# EAGLE board ledCubeV2.0 (EAGLE 9.6.2)
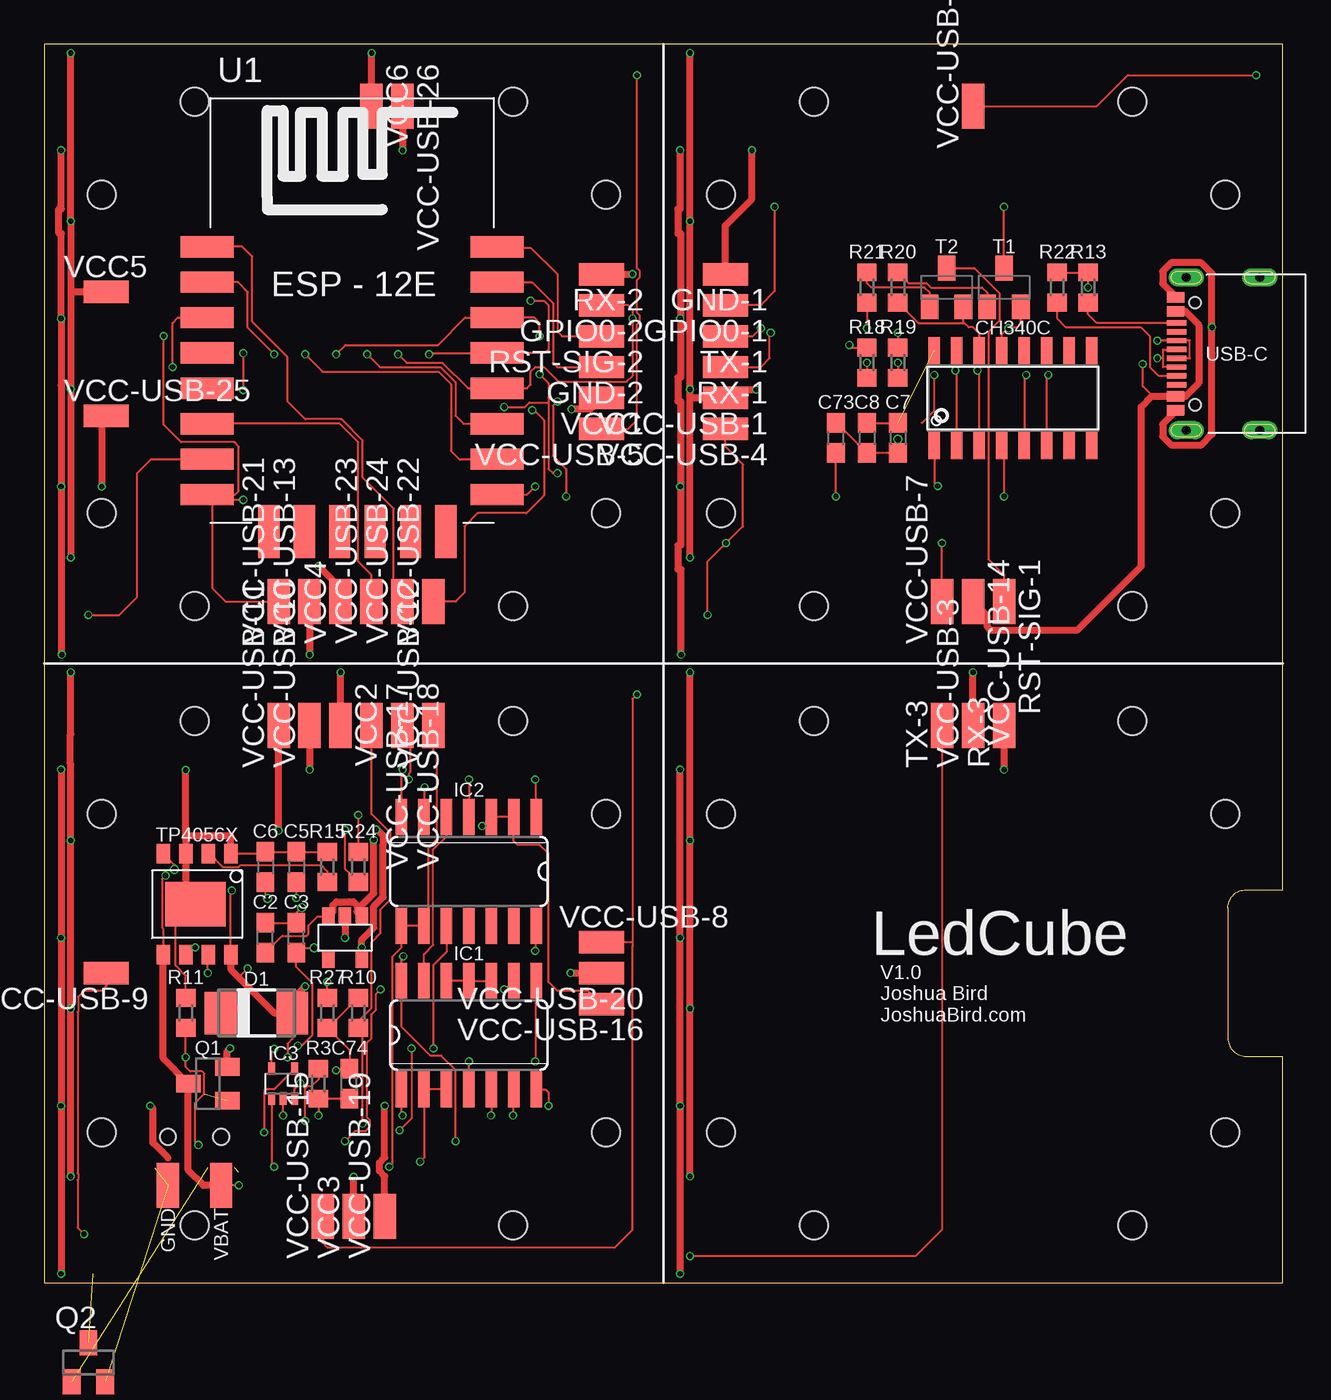
[diagram p2: board, top side]
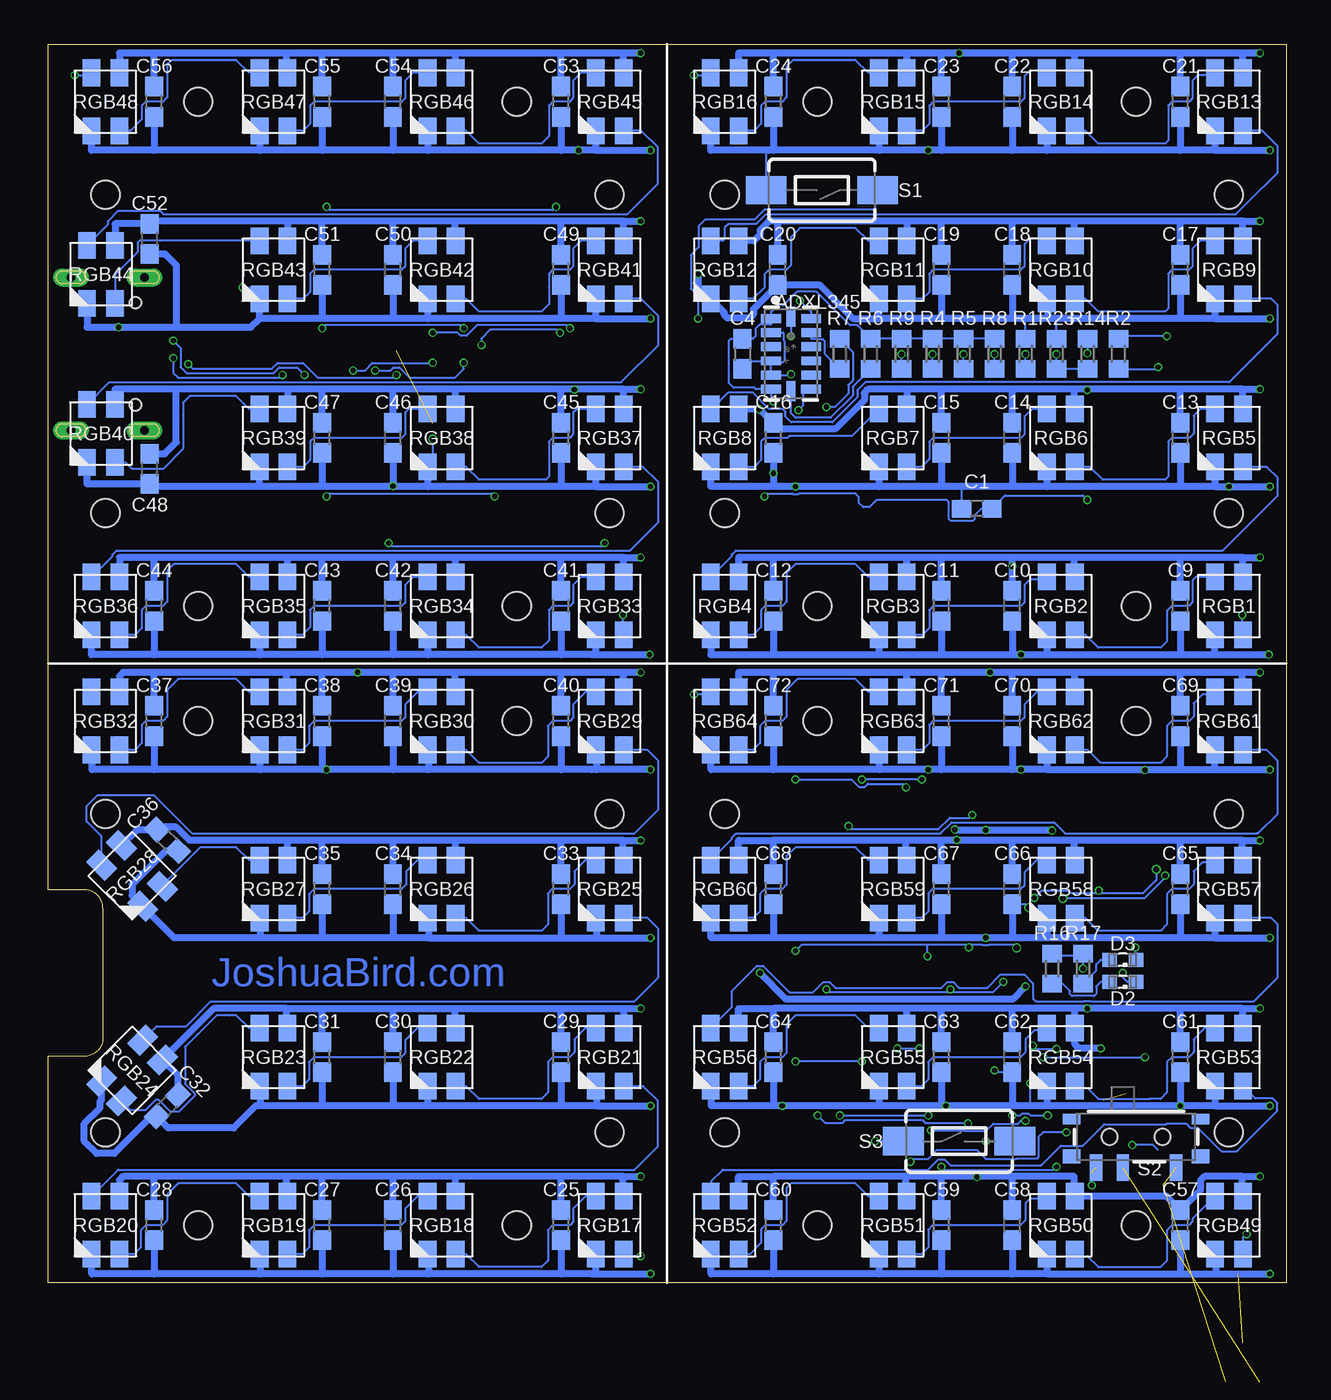
[diagram p3: board, bottom side, seen from below]

Size 70 x 70 mm. Coordinates in mm from the lower left corner, seen from the top.
Outline: 0,0 70,0 70,12.8 67.92,12.8 arc-90 66.9,13.82 66.9,21.18 arc-90 67.92,22.2 70,22.2 70,70 0,70 0,0
Copper layers (1*16): Top 0.035mm / dielectric 1.6mm / Bottom 0.035mm
Design rules "jlcpcb-2layers *": minimum track width 5mil, minimum drill 0.2mm, track to track 5mil, track to pad 5mil, pad to pad 5mil, via to via 5mil, smd to smd 5mil, copper to edge 0.2mm, drill to drill 6mil, minimum pad ring 10mil, minimum via ring 3mil, stop-mask expansion 4mil, vias tented up to drill 0.35mm, thermal gap 10mil
Net classes: 0 default: clearance 0.127 mm
Holes 1.6 mm at 43.5,31.75 61.5,31.75 66.75,26.5 66.75,8.5 61.5,3.25 43.5,3.25 38.25,8.5 38.25,26.5 26.5,31.75 31.75,26.5 26.5,38.25 31.75,43.5 38.25,43.5 43.5,38.25 61.5,38.25 66.75,43.5 66.75,61.5 61.5,66.75 43.5,66.75 38.25,61.5 26.5,66.75 31.75,61.5 8.5,66.75 3.25,61.5 8.5,38.25 3.25,43.5 8.5,31.75 3.25,26.5 8.5,3.25 31.75,8.5 26.5,3.25 3.25,8.5

## Footprints (pad centres in the part's own frame; a part is rotated, then mirrored left to right if it is on the bottom)
LGA-14 = smd 0.5 x 1.124: 1 2,1.138; 2 1.2,1.138; 3 0.4,1.138; 4 -0.4,1.138; 5 -1.2,1.138; 6 -2,1.138; 8 -2,-1.13; 9 -1.2,-1.138; 10 -0.4,-1.138; 11 0.4,-1.138; 12 1.2,-1.138; 13 2,-1.138 | smd 1.124 x 0.5: 7 -2.1,0; 14 2.1,0
C0603 = smd 1.1 x 1: 1 -0.85,0; 2 0.85,0
SOIC16 = smd 0.635 x 1.524: 1 -4.445,-2.695; 2 -3.175,-2.695; 3 -1.905,-2.695; 4 -0.635,-2.695; 5 0.635,-2.695; 6 1.905,-2.695; 7 3.175,-2.695; 8 4.445,-2.695; 9 4.445,2.695; 10 3.175,2.695; 11 1.905,2.695; 12 0.635,2.695; 13 -0.635,2.695; 14 -1.905,2.695; 15 -3.175,2.695; 16 -4.445,2.695
DO-214AC = smd 1.8 x 2.4: A 2.025,0; C -2.025,0
LED_SML0603 = smd 0.8 x 0.8: A 0.75,0; C -0.75,0
SMD1,27-2,54 = smd 1.27 x 2.54: 1 0,0
SO14 = smd 0.66 x 2.032: 1 -3.81,-3.073; 2 -2.54,-3.073; 3 -1.27,-3.073; 4 0,-3.073; 5 1.27,-3.073; 6 2.54,-3.073; 7 3.81,-3.073; 8 3.81,3.073; 9 2.54,3.073; 10 1.27,3.073; 11 0,3.073; 12 -1.27,3.073; 13 -2.54,3.073; 14 -3.81,3.073
SC70-5 = smd 0.4 x 0.7: 1 -0.65,-0.85; 2 0,-0.85; 3 0.65,-0.85; 4 0.65,0.85; 5 -0.65,0.85
TSOP-5 = smd 0.7 x 1: 1 0.95,0.95; 2 0,0.95; 3 -0.95,0.95; 4 -0.95,-1.45; 5 0.95,-1.45
SOT23 = smd 1 x 1.4: 1 -0.95,-1.1; 2 0.95,-1.1; 3 0,1.1
R0603 = smd 1 x 1.1: 1 -0.85,0; 2 0.85,0
WS2812B-MINI = smd 1.5 x 1: 1 -1.64,0.79; 2 -1.64,-0.79; 3 1.64,-0.79; 4 1.64,0.79
TACTILE_SWITCH_SMD_6.0X3.5MM = smd 2.3 x 1.6: 1 -3.15,0; 2 3.15,0
SWITCH_SPST_SMD_A = smd 0.7 x 1.5: 1 -2.25,-1.75; 2 -0.75,-1.75; 3 2.25,-1.75 | smd 1 x 0.6: GND1 -3.65,1; GND3 3.65,1 | smd 1 x 0.8: GND2 -3.65,-1.1; GND4 3.65,-1.1 | hole 0.9: -1.5,0; 1.5,0
SOT23-BEC = smd 1 x 1.4: B -0.95,-1.1; C 0,1.1; E 0.95,-1.1
ESPO8 = smd 1.1 x 0.76: 1 0,2.54; 2 0,1.27; 3 0,0; 4 0,-1.27; 5 5.7,-1.27; 6 5.7,0; 7 5.7,1.27; 8 5.7,2.54 | smd 2.513 x 3.402: 9 2.85,0.55
ESP12E-SMD = smd 3 x 1.2: ADC -8.3,3.8; CH_PD -8.3,1.8; GND 8.1,-8.2; GPIO0 8.1,-2.2; GPIO2 8.1,-4.2; GPIO4 8.1,-0.2; GPIO5 8.1,1.8; GPIO12 -8.3,-4.2; GPIO13 -8.3,-6.2; GPIO14 -8.3,-2.2; GPIO15 8.1,-6.2; GPIO16 -8.3,-0.2; RESET -8.3,5.8; RXD0 8.1,3.8; TXD0 8.1,5.8; VCC -8.3,-8.2 | smd 1.2 x 3: CS0 -4.8,-10.3; GPIO9 -0.8,-10.3; GPIO10 1.2,-10.3; MISO -2.8,-10.3; MOSI 3.2,-10.3; SCLK 5.2,-10.3
USB-C = smd 0.6 x 1: 1 -3.2,0.05; 2 -2.4,0.05; 11 2.4,0.05; 12 3.2,0.05 | smd 0.3 x 1.1: 3 -1.75,0; 4 -1.25,0; 5 -0.75,0; 6 -0.25,0; 7 0.25,0; 8 0.75,0; 9 1.25,0; 10 1.75,0 | drill 0.5 long: P$1 -4.32,-0.55; P$2 4.32,-0.55; P$3 4.32,-4.7; P$5 -4.32,-4.7 | hole 0.65: -2.89,-1.05; 2.89,-1.05

## Placement (x,y rotation side)
ADXL345  [LGA-14]  28,52.5 90 bottom
C1  0.1uF  [C0603]  17.5,43.75 180 bottom
C2  1uF  [C0603]  12.5,19.5 90 top
C3  1uF  [C0603]  14.25,19.5 90 top
C4  0.1uF  [C0603]  30.75,52.5 270 bottom
C5  0.1uF  [C0603]  14.25,23.5 270 top
C6  0.1uF  [C0603]  12.5,23.5 270 top
C7  10uF  [C0603]  48.25,47.75 270 top
C8  0.1uF  [C0603]  46.5,47.75 270 top
C9  0.1uF  [C0603]  6,38.25 90 bottom
C10  0.1uF  [C0603]  15.5,38.25 90 bottom
C11  0.1uF  [C0603]  19.5,38.25 90 bottom
C12  0.1uF  [C0603]  29,38.25 90 bottom
C13  0.1uF  [C0603]  6,47.75 90 bottom
C14  0.1uF  [C0603]  15.5,47.75 90 bottom
C15  0.1uF  [C0603]  19.5,47.75 90 bottom
C16  0.1uF  [C0603]  29,47.75 90 bottom
C17  0.1uF  [C0603]  6,57.25 90 bottom
C18  0.1uF  [C0603]  15.5,57.25 90 bottom
C19  0.1uF  [C0603]  19.5,57.25 90 bottom
C20  0.1uF  [C0603]  28.75,57.25 90 bottom
C21  0.1uF  [C0603]  6,66.75 90 bottom
C22  0.1uF  [C0603]  15.5,66.75 90 bottom
C23  0.1uF  [C0603]  19.5,66.75 90 bottom
C24  0.1uF  [C0603]  29,66.75 90 bottom
C25  0.1uF  [C0603]  41,3.25 90 bottom
C26  0.1uF  [C0603]  50.5,3.25 90 bottom
C27  0.1uF  [C0603]  54.5,3.25 90 bottom
C28  0.1uF  [C0603]  64,3.25 90 bottom
C29  0.1uF  [C0603]  41,12.75 90 bottom
C30  0.1uF  [C0603]  50.5,12.75 90 bottom
C31  0.1uF  [C0603]  54.5,12.75 90 bottom
C32  0.1uF  [C0603]  63.25,10 45 bottom
C33  0.1uF  [C0603]  41,22.25 90 bottom
C34  0.1uF  [C0603]  50.5,22.25 90 bottom
C35  0.1uF  [C0603]  54.5,22.25 90 bottom
C36  0.1uF  [C0603]  63.25,25 135 bottom
C37  0.1uF  [C0603]  64,31.75 90 bottom
C38  0.1uF  [C0603]  54.5,31.75 90 bottom
C39  0.1uF  [C0603]  50.5,31.75 90 bottom
C40  0.1uF  [C0603]  41,31.75 90 bottom
C41  0.1uF  [C0603]  41,38.25 90 bottom
C42  0.1uF  [C0603]  50.5,38.25 90 bottom
C43  0.1uF  [C0603]  54.5,38.25 90 bottom
C44  0.1uF  [C0603]  64,38.25 90 bottom
C45  0.1uF  [C0603]  41,47.75 90 bottom
C46  0.1uF  [C0603]  50.5,47.75 90 bottom
C47  0.1uF  [C0603]  54.5,47.75 90 bottom
C48  0.1uF  [C0603]  64.25,46 90 bottom
C49  0.1uF  [C0603]  41,57.25 90 bottom
C50  0.1uF  [C0603]  50.5,57.25 90 bottom
C51  0.1uF  [C0603]  54.5,57.25 90 bottom
C52  0.1uF  [C0603]  64.25,59 90 bottom
C53  0.1uF  [C0603]  41,66.75 90 bottom
C54  0.1uF  [C0603]  50.5,66.75 90 bottom
C55  0.1uF  [C0603]  54.5,66.75 90 bottom
C56  0.1uF  [C0603]  64,66.75 90 bottom
C57  0.1uF  [C0603]  6,3.25 90 bottom
C58  0.1uF  [C0603]  15.5,3.25 90 bottom
C59  0.1uF  [C0603]  19.5,3.25 90 bottom
C60  0.1uF  [C0603]  29,3.25 90 bottom
C61  0.1uF  [C0603]  6,12.75 90 bottom
C62  0.1uF  [C0603]  15.5,12.75 90 bottom
C63  0.1uF  [C0603]  19.5,12.75 90 bottom
C64  0.1uF  [C0603]  29,12.75 90 bottom
C65  0.1uF  [C0603]  6,22.25 90 bottom
C66  0.1uF  [C0603]  15.5,22.25 90 bottom
C67  0.1uF  [C0603]  19.5,22.25 90 bottom
C68  0.1uF  [C0603]  29,22.25 90 bottom
C69  0.1uF  [C0603]  6,31.75 90 bottom
C70  0.1uF  [C0603]  15.5,31.75 90 bottom
C71  0.1uF  [C0603]  19.5,31.75 90 bottom
C72  0.1uF  [C0603]  29,31.75 90 bottom
C73  0.1uF  [C0603]  44.75,47.75 90 top
C74  1uF  [C0603]  17.25,11.25 90 top
CH340C  CH340G  [SOIC16]  54.75,50 0 top
D1  SS14  [DO-214AC]  12,15.25 0 top
D2  RED  [LED_SML0603]  9.25,17 180 bottom
D3  GREEN  [LED_SML0603]  9.25,18.25 180 bottom
GND  [SMD1,27-2,54]  7,5.5 0 top
GND-1  GND  [SMD1,27-2,54]  38.5,57 90 top
GND-2  RX  [SMD1,27-2,54]  31.5,51.75 90 top
GPIO0-1  GPIO0  [SMD1,27-2,54]  38.5,55.25 90 top
GPIO0-2  GPIO0  [SMD1,27-2,54]  31.5,55.25 90 top
IC1  74HC02D  [SO14]  24,14 0 top
IC2  74HC02D  [SO14]  24,23.25 180 top
IC3  74AHC1G08DCK  [SC70-5]  13.5,11.25 0 top
NCP114  NCP114  [TSOP-5]  17,19.75 0 top
Q1  BSS84  [SOT23]  9.25,11.25 90 top
Q2  BSS123  [SOT23]  2.5,-4.5 0 top  (outside the outline)
R1  10k  [R0603]  14.75,52.5 270 bottom
R2  10k  [R0603]  9.5,52.5 270 bottom
R3  10k  [R0603]  15.5,11.25 270 top
R4  10k  [R0603]  20,52.5 270 bottom
R5  10k  [R0603]  18.25,52.5 270 bottom
R6  10k  [R0603]  23.5,52.5 90 bottom
R7  10k  [R0603]  25.25,52.5 90 bottom
R8  10k  [R0603]  16.5,52.5 90 bottom
R9  10k  [R0603]  21.75,52.5 90 bottom
R10  10k  [R0603]  17.75,15.25 90 top
R11  10k  [R0603]  8,15.25 270 top
R13  5.1k  [R0603]  59,56.25 270 top
R14  10k  [R0603]  11.25,52.5 90 bottom
R15  5.1k  [R0603]  16,23.5 270 top
R16  5.1k  [R0603]  13.25,17.75 90 bottom
R17  5.1k  [R0603]  11.5,17.75 90 bottom
R18  470  [R0603]  46.5,52 270 top
R19  470  [R0603]  48.25,52 270 top
R20  10k  [R0603]  48.25,56.25 270 top
R21  10k  [R0603]  46.5,56.25 270 top
R22  5.1k  [R0603]  57.25,56.25 270 top
R23  2.7k  [R0603]  13,52.5 90 bottom
R24  10k  [R0603]  17.75,23.5 90 top
R27  10k  [R0603]  16,15.25 270 top
RGB1  WS2812B  [WS2812B-MINI]  3.25,38.25 270 bottom
RGB2  WS2812B  [WS2812B-MINI]  12.75,38.25 270 bottom
RGB3  WS2812B  [WS2812B-MINI]  22.25,38.25 270 bottom
RGB4  WS2812B  [WS2812B-MINI]  31.75,38.25 270 bottom
RGB5  WS2812B  [WS2812B-MINI]  3.25,47.75 270 bottom
RGB6  WS2812B  [WS2812B-MINI]  12.75,47.75 270 bottom
RGB7  WS2812B  [WS2812B-MINI]  22.25,47.75 270 bottom
RGB8  WS2812B  [WS2812B-MINI]  31.75,47.75 270 bottom
RGB9  WS2812B  [WS2812B-MINI]  3.25,57.25 270 bottom
RGB10  WS2812B  [WS2812B-MINI]  12.75,57.25 270 bottom
RGB11  WS2812B  [WS2812B-MINI]  22.25,57.25 270 bottom
RGB12  WS2812B  [WS2812B-MINI]  31.75,57.25 270 bottom
RGB13  WS2812B  [WS2812B-MINI]  3.25,66.75 270 bottom
RGB14  WS2812B  [WS2812B-MINI]  12.75,66.75 270 bottom
RGB15  WS2812B  [WS2812B-MINI]  22.25,66.75 270 bottom
RGB16  WS2812B  [WS2812B-MINI]  31.75,66.75 270 bottom
RGB17  WS2812B  [WS2812B-MINI]  38.25,3.25 270 bottom
RGB18  WS2812B  [WS2812B-MINI]  47.75,3.25 270 bottom
RGB19  WS2812B  [WS2812B-MINI]  57.25,3.25 270 bottom
RGB20  WS2812B  [WS2812B-MINI]  66.75,3.25 270 bottom
RGB21  WS2812B  [WS2812B-MINI]  38.25,12.75 270 bottom
RGB22  WS2812B  [WS2812B-MINI]  47.75,12.75 270 bottom
RGB23  WS2812B  [WS2812B-MINI]  57.25,12.75 270 bottom
RGB24  WS2812B  [WS2812B-MINI]  65.25,12 225 bottom
RGB25  WS2812B  [WS2812B-MINI]  38.25,22.25 270 bottom
RGB26  WS2812B  [WS2812B-MINI]  47.75,22.25 270 bottom
RGB27  WS2812B  [WS2812B-MINI]  57.25,22.25 270 bottom
RGB28  WS2812B  [WS2812B-MINI]  65.25,23 315 bottom
RGB29  WS2812B  [WS2812B-MINI]  38.25,31.75 270 bottom
RGB30  WS2812B  [WS2812B-MINI]  47.75,31.75 270 bottom
RGB31  WS2812B  [WS2812B-MINI]  57.25,31.75 270 bottom
RGB32  WS2812B  [WS2812B-MINI]  66.75,31.75 270 bottom
RGB33  WS2812B  [WS2812B-MINI]  38.25,38.25 270 bottom
RGB34  WS2812B  [WS2812B-MINI]  47.75,38.25 270 bottom
RGB35  WS2812B  [WS2812B-MINI]  57.25,38.25 270 bottom
RGB36  WS2812B  [WS2812B-MINI]  66.75,38.25 270 bottom
RGB37  WS2812B  [WS2812B-MINI]  38.25,47.75 270 bottom
RGB38  WS2812B  [WS2812B-MINI]  47.75,47.75 270 bottom
RGB39  WS2812B  [WS2812B-MINI]  57.25,47.75 270 bottom
RGB40  WS2812B  [WS2812B-MINI]  67,48 270 bottom
RGB41  WS2812B  [WS2812B-MINI]  38.25,57.25 270 bottom
RGB42  WS2812B  [WS2812B-MINI]  47.75,57.25 270 bottom
RGB43  WS2812B  [WS2812B-MINI]  57.25,57.25 270 bottom
RGB44  WS2812B  [WS2812B-MINI]  67,57 270 bottom
RGB45  WS2812B  [WS2812B-MINI]  38.25,66.75 270 bottom
RGB46  WS2812B  [WS2812B-MINI]  47.75,66.75 270 bottom
RGB47  WS2812B  [WS2812B-MINI]  57.25,66.75 270 bottom
RGB48  WS2812B  [WS2812B-MINI]  66.75,66.75 270 bottom
RGB49  WS2812B  [WS2812B-MINI]  3.25,3.25 270 bottom
RGB50  WS2812B  [WS2812B-MINI]  12.75,3.25 270 bottom
RGB51  WS2812B  [WS2812B-MINI]  22.25,3.25 270 bottom
RGB52  WS2812B  [WS2812B-MINI]  31.75,3.25 270 bottom
RGB53  WS2812B  [WS2812B-MINI]  3.25,12.75 270 bottom
RGB54  WS2812B  [WS2812B-MINI]  12.75,12.75 270 bottom
RGB55  WS2812B  [WS2812B-MINI]  22.25,12.75 270 bottom
RGB56  WS2812B  [WS2812B-MINI]  31.75,12.75 270 bottom
RGB57  WS2812B  [WS2812B-MINI]  3.25,22.25 270 bottom
RGB58  WS2812B  [WS2812B-MINI]  12.75,22.25 270 bottom
RGB59  WS2812B  [WS2812B-MINI]  22.25,22.25 270 bottom
RGB60  WS2812B  [WS2812B-MINI]  31.75,22.25 270 bottom
RGB61  WS2812B  [WS2812B-MINI]  3.25,31.75 270 bottom
RGB62  WS2812B  [WS2812B-MINI]  12.75,31.75 270 bottom
RGB63  WS2812B  [WS2812B-MINI]  22.25,31.75 270 bottom
RGB64  WS2812B  [WS2812B-MINI]  31.75,31.75 270 bottom
RST-SIG-1  RST-SIG  [SMD1,27-2,54]  54.25,38.5 180 top
RST-SIG-2  TX  [SMD1,27-2,54]  31.5,53.5 90 top
RX-1  RX  [SMD1,27-2,54]  38.5,51.75 90 top
RX-2  GND  [SMD1,27-2,54]  31.5,57 90 top
RX-3  GND  [SMD1,27-2,54]  54.25,31.5 0 top
S1  prog  [TACTILE_SWITCH_SMD_6.0X3.5MM]  26.25,61.75 180 bottom
S2  ON/CHRG  [SWITCH_SPST_SMD_A]  8.5,8.25 0 bottom
S3  reset  [TACTILE_SWITCH_SMD_6.0X3.5MM]  18.5,8 0 bottom
T1  PMBT3904  [SOT23-BEC]  54.25,56.25 0 top
T2  PMBT3904  [SOT23-BEC]  51,56.25 0 top
TP4056X  [ESPO8]  8,24.25 270 top
TX-1  TX  [SMD1,27-2,54]  38.5,53.5 90 top
TX-3  DIN  [SMD1,27-2,54]  50.75,31.5 0 top
U1  ESP12-E  [ESP12E-SMD]  17.5,52.75 0 top
USB-C  USB-C  [USB-C]  64,52.5 90 top
VBAT  [SMD1,27-2,54]  10,5.5 180 top
VCC1  VBAT  [SMD1,27-2,54]  31.5,50 90 top
VCC2  VBAT  [SMD1,27-2,54]  16.75,31.5 180 top
VCC3  VBAT  [SMD1,27-2,54]  17.5,3.75 0 top
VCC4  VBAT  [SMD1,27-2,54]  16.75,38.5 0 top
VCC5  VBAT  [SMD1,27-2,54]  3.5,56 270 top
VCC6  VBAT  [SMD1,27-2,54]  18.5,66.5 180 top
VCC-USB-1  VBAT  [SMD1,27-2,54]  38.5,50 90 top
VCC-USB-3  VBAT  [SMD1,27-2,54]  52.5,31.5 0 top
VCC-USB-4  DIN  [SMD1,27-2,54]  38.5,48.25 90 top
VCC-USB-5  DOUT  [SMD1,27-2,54]  31.5,48.25 90 top
VCC-USB-6  DOUT  [SMD1,27-2,54]  52.5,66.5 0 top
VCC-USB-7  DIN  [SMD1,27-2,54]  50.75,38.5 0 top
VCC-USB-8  DOUT  [SMD1,27-2,54]  31.5,19.25 270 top
VCC-USB-9  DIN  [SMD1,27-2,54]  3.5,17.5 90 top
VCC-USB-10  GND  [SMD1,27-2,54]  15,31.5 0 top
VCC-USB-11  VCC  [SMD1,27-2,54]  13.25,31.5 0 top
VCC-USB-12  INT1  [SMD1,27-2,54]  22,31.5 0 top
VCC-USB-13  GND  [SMD1,27-2,54]  15,38.5 0 top
VCC-USB-14  VCC-USB  [SMD1,27-2,54]  52.5,38.5 180 top
VCC-USB-15  DOUT  [SMD1,27-2,54]  15.75,3.75 0 top
VCC-USB-16  RST-SIG  [SMD1,27-2,54]  31.5,15.75 90 top
VCC-USB-17  GPIO12  [SMD1,27-2,54]  18.5,31.5 180 top
VCC-USB-18  RST-PIN  [SMD1,27-2,54]  20.25,31.5 180 top
VCC-USB-19  GND  [SMD1,27-2,54]  19.25,3.75 0 top
VCC-USB-20  VCC-USB  [SMD1,27-2,54]  31.5,17.5 90 top
VCC-USB-21  VCC  [SMD1,27-2,54]  13.25,38.5 0 top
VCC-USB-22  INT1  [SMD1,27-2,54]  22,38.5 0 top
VCC-USB-23  GPIO12  [SMD1,27-2,54]  18.5,38.5 0 top
VCC-USB-24  RST-PIN  [SMD1,27-2,54]  20.25,38.5 0 top
VCC-USB-25  GND  [SMD1,27-2,54]  3.5,49 270 top
VCC-USB-26  GND  [SMD1,27-2,54]  20.25,66.5 180 top

## Tracks (layer width: path | path; a pad name or v marks a point on that pad's centre or on a via)
ADC  (via drill 0.3)
  Top 0.127: v13,52.47 11.5,53.97 11.5,56 10.95,56.55 U1.ADC
  Bottom 0.127: v13,52.47 R23.1 R14.1
D+  (via drill 0.3)
  Top 0.127: USB-C.6 64.75,52.25 64.75,53.25 USB-C.8 v62.92,53.25 | v55.5,51.31 55.38,51.19 CH340C.5
  Bottom 0.127: v62.92,53.25 62.5,52.83 62.5,51.75 62.15,51.4 57.25,51.4 56.92,51.72 55.92,51.72 v55.5,51.31
D-  (via drill 0.3)
  Top 0.127: USB-C.7 63.25,52.75 63.25,52.25 | USB-C.5 63.25,51.75 63.25,52.25 | 63.25,52.25 v62.92,52.25 | v56.75,51.31 56.66,51.21 CH340C.6
  Bottom 0.127: v62.92,52.25 62.92,51.42 62.65,51.14 56.91,51.14 v56.75,51.31
DIN-1  (via drill 0.3)
  Top 0.127: VCC-USB-7.1 v50.75,41.81 | v37.5,37.75 37.5,40.77 v38.53,41.81 39.48,42.75 39.5,42.75 39.5,46.25 38.5,47.25 VCC-USB-4.1
  Bottom 0.127: v50.75,41.81 50.59,41.64 38.7,41.64 v38.53,41.81 | RGB33.4 37.5,36.65 v37.5,37.75
DIN-2  (via drill 0.3)
  Top 0.127: VCC-USB-9.1 3.5,16.75 3.25,16.5 2.25,16.5 1.92,16.17 1.92,15.33 1.89,15.3 1.89,6.2 1.92,6.17 1.92,5.83 1.89,5.8 1.89,3.11 v2.25,2.75
  Bottom 0.127: v2.25,2.75 2.46,2.54 RGB49.4
DIN-4  (via drill 0.3)
  Top 0.127: TX-3.1 50.75,3 49.25,1.5 v36.5,1.5
  Bottom 0.127: v36.5,1.5 37.35,1.5 RGB17.4
DOUT-1  (via drill 0.3)
  Top 0.127: VCC-USB-6.1 59.5,66.5 61.25,68.25 v68.5,68.25
  Bottom 0.127: v68.5,68.25 67.68,68.25 RGB48.2
DOUT-2  (via drill 0.3)
  Top 0.127: VCC-USB-15.1 15.75,2.25 16,2 32.25,2 33.25,3 33.25,19 33.25,19.25 | v33.5,33.25 33.25,33 33.25,19.25 | VCC-USB-8.1 33.25,19.25
  Bottom 0.127: RGB64.2 32.68,33.25 v33.5,33.25
DOUT-3  (via drill 0.3)
  Top 0.127: VCC-USB-5.1 33,48.25 33.5,48.75 33.5,54.16 33.67,54.33 33.67,54.67 33.5,54.84 33.5,56.66 33.67,56.83 33.67,57.17 33.5,57.34 v33.5,68.25
  Bottom 0.127: v33.5,68.25 32.68,68.25 RGB16.2
DTR  (via drill 0.3)
  Top 0.127: CH340C.13 54.12,53.61 54.5,54 | 54.5,54 55,54 55.2,54.2 T1.E | R21.2 v46.5,53.95 | v54.5,53.95 54.5,54
  Bottom 0.127: v46.5,53.95 46.66,54.11 54.34,54.11 v54.5,53.95
EN  (via drill 0.3)
  Top 0.127: v7.25,51.75 7.25,54.25 7.55,54.55 U1.CH_PD
  Bottom 0.127: R2.2 7.35,51.65 v7.25,51.75
GND-1  (via drill 0.3, 0.35)
  Top 0.127: R22.1 R13.1 v59,56.25 | C73.2 44.8,48.6 C8.2 C7.2 v48.25,47.67 | CH340C.1 50.3,45.22 v50.5,45.03
  Top 0.4: USB-C.1 63.95,49.26 63.22,48.52 63.22,47.84 63.7,47.35 65.4,47.35 66,47.95 66,52.5 v66,54 66,57.05 65.4,57.65 63.7,57.65 63.22,57.16 63.22,56.48 63.95,55.74 USB-C.12 | v36,35.5 36,40.32 | 36,40.32 35.82,40.32 | v35.95,64 35.95,60.68 35.82,60.68 35.82,59.32 35.97,59.32 35.97,54.5 | 35.97,54.5 35.97,51.18 35.82,51.18 35.82,49.82 35.97,49.82 35.97,45 | 35.82,40.32 35.82,41.68 35.97,41.68 35.97,45 | 35.82,40.32 36,40.32 | v35.95,45 35.97,45 | v35.95,54.5 35.97,54.5 | GND-1.1 38.5,59.75 40,61.25 v40,64
  Bottom 0.127: v59,56.25 58.25,56.25 58.04,56.04 RGB43.3 | 48.25,46.4 RGB38.3 48.25,46.4 | v48.25,47.67 48.25,46.4
  Bottom 0.4: RGB33.3 39.04,35.5 39.25,35.5 | RGB36.3 67.54,35.5 64,35.5 | 39.25,35.5 41,35.5 | 41,35.5 48.5,35.5 | 48.5,35.5 50.5,35.5 | 50.5,35.5 54.5,35.5 | 54.5,35.5 58,35.5 | 58,35.5 64,35.5 | C44.1 64,35.5 | RGB35.3 58.04,35.5 58,35.5 | C43.1 54.5,35.5 | C42.1 50.5,35.5 | RGB34.3 48.54,35.5 48.5,35.5 | C41.1 41,35.5 | RGB37.3 39.04,45 | 58.04,45 RGB39.3 | 39.04,45 41,45 | 41,45 48.5,45 | 48.5,45 50.5,45 | 50.5,45 54.5,45 | 54.5,45 58.04,45 | C47.1 54.5,45 | C46.1 v50.5,45.03 50.5,45 | RGB38.3 48.54,45 48.5,45 | C45.1 41,45 | 58.04,45 64.25,45 C48.1 67.79,45.15 RGB40.3 | RGB41.3 39.04,54.5 | 58.04,54.5 RGB43.3 | 39.04,54.5 41,54.5 | 41,54.5 48.5,54.5 | 48.5,54.5 50.5,54.5 | 50.5,54.5 54.5,54.5 | 54.5,54.5 58.04,54.5 | C51.1 54.5,54.5 | C50.1 50.5,54.5 | RGB42.3 48.54,54.5 48.5,54.5 | C49.1 41,54.5 | RGB44.3 67.79,54 v66,54 62.75,54 | 58.04,54.5 58.54,54 62.75,54 | C52.1 63.4,58.15 62.75,57.5 62.75,54 | RGB45.3 39.04,64 | RGB48.3 67.54,64 64,64 | 39.04,64 v40,64 41,64 | 41,64 48.5,64 | 48.5,64 50.5,64 | 50.5,64 54.5,64 | 54.5,64 58,64 | 58,64 64,64 | C56.1 64,64 | RGB47.3 58.04,64 58,64 | C55.1 54.5,64 | C54.1 50.5,64 | RGB46.3 48.54,64 48.5,64 | C53.1 41,64 | 39.25,35.5 v36,35.5 | 39.04,45 v35.95,45 | 39.04,54.5 v35.95,54.5 | 39.04,64 v35.95,64
GND-2  (via drill 0.3, 0.35)  (1 unrouted)
  Top 0.127: R15.1 C5.1 C6.1 12.4,24.25 TP4056X.1 | R11.1 8,17.35 7.43,17.92 7.43,20.58 8.25,21.4 | C2.2 C3.2 14.25,20.89 v14.55,21.2 | R10.2 16.05,14.4 R27.2 17.25,13.15 C74.2 16.6,12.1 v16.5,12 | IC2.7 20.19,28.94 v20.25,29 | IC1.7 28.32,10.93 28.5,10.75 v28.5,10 | IC3.3 14.15,10.96 v14.47,11.28
  Top 0.4: v0.95,29 v0.95,19.5 v0.95,10 v0.95,0.5 | TP4056X.1 10.54,25.25 8,25.25 | 8,25.25 TP4056X.3 8,21.4 8.25,21.4 TP4056X.9 | v6,10 6.15,9.85 6.15,7.9 7,7.05 | NCP114.2 v17,19.5 | VCC-USB-10.1 v15,29 | VCC-USB-19.1 19.25,6.02 18.95,6.32 18.95,6.78 19.25,7.09 v19.25,10 | 8,25.25 v8,28.97
  Bottom 0.127: C62.1 16.4,11.9 v16.5,12 | v14.47,11.28 14.5,11.25 14.5,10 | C66.1 14.76,21.4 v14.55,21.2
  Bottom 0.4: 13.5,0.5 15.5,0.5 | 15.5,0.5 19.5,0.5 | 19.5,0.5 23,0.5 | 23,0.5 29,0.5 | 29,0.5 32.5,0.5 32.54,0.54 RGB52.3 | RGB51.3 23.04,0.54 23,0.5 | RGB50.3 13.54,0.54 13.5,0.5 | 13.5,0.5 6,0.5 | 6,0.5 4,0.5 | 4,0.5 2.75,0.5 v0.95,0.5 | RGB49.3 4,1.57 4,0.5 | C57.1 6,0.5 | C58.1 15.5,0.5 | C59.1 19.5,0.5 | C60.1 29,0.5 | v6,10 13.5,10 | 13.5,10 14.05,10 14.5,10 15.5,10 | 15.5,10 v19.25,10 19.5,10 | 19.5,10 23,10 | 23,10 23.25,10 v28.5,10 29,10 | 29,10 32.5,10 32.5,11.07 RGB56.3 | RGB55.3 23.04,10.04 23,10 | RGB54.3 13.54,10.04 13.5,10 | C61.1 v6,10 | C62.1 15.5,10 | C63.1 19.5,10 | C64.1 29,10 | 6,19.5 13.5,19.5 | 13.5,19.5 15.5,19.5 | 15.5,19.5 v17,19.5 19.5,19.5 | 19.5,19.5 23,19.5 | 23,19.5 29,19.5 | 29,19.5 32.5,19.5 32.54,19.54 RGB60.3 | RGB59.3 23.04,19.54 23,19.5 | C68.1 29,19.5 | C67.1 19.5,19.5 | C66.1 15.5,19.5 | RGB58.3 13.54,19.54 13.5,19.5 | C65.1 6,19.5 | 13.5,29 v15,29 15.5,29 | 15.5,29 19.5,29 | 19.5,29 v20.25,29 23,29 | 23,29 29,29 | 29,29 32.5,29 32.54,29.04 RGB64.3 | RGB63.3 23.04,29.04 23,29 | RGB62.3 13.54,29.04 13.5,29 | RGB61.3 4.04,29 4.25,29 | 13.5,29 8,29 | 8,29 6,29 | 6,29 4.25,29 | C69.1 6,29 | C70.1 15.5,29 | C71.1 19.5,29 | C72.1 29,29 | RGB57.3 4.04,19.5 | 4.04,19.5 6,19.5 | RGB53.3 4.04,10 | 4.04,10 v6,10 | 4.25,29 v0.95,29 | 4.04,10 v0.95,10 | 4.04,19.5 v0.95,19.5 | v8,28.97 8,29
GND-3  (via drill 0.3)
  Top 0.127: 25.52,44.48 25.3,44.25 25.52,44.48 | 25.52,44.48 U1.GND 27.3,44.55 v27.75,45 | v28,51.34 28.5,50.84 28.5,50 28.5,49.75 | 28.5,49.75 28.5,46 28.75,45.75 v29,45.75 | v26,49.5 27.18,49.5 27.43,49.75 28.5,49.75
  Top 0.4: VCC-USB-13.1 v15,35.5 | RX-2.1 v33.25,57 | VCC-USB-26.1 v20.25,64 | 0.97,54.5 0.97,59.32 0.82,59.32 0.82,60.68 0.97,60.68 0.97,64 v0.95,64 | v0.95,54.5 0.97,54.5 | v1,35.5 0.95,35.55 v0.95,45 0.95,50.73 0.97,50.76 0.97,54.5 | VCC-USB-25.1 3.25,48.75 v3.25,45
  Bottom 0.127: R23.2 13,54.5 | R1.1 14.75,54.5 | 29.14,52 ADXL345.5 28.04,51.3 v28,51.34 | 29.14,52 ADXL345.4 30,52.1 30.3,52.1 C4.2 | S1.2 29.4,63.85 29.25,64 | ADXL345.2 28.45,53.7 28.42,53.67 28.42,53.26 28.39,53.23 28.39,52.11 28.5,52 29.14,52 | R7.2 24.51,52.61 24.51,51 24.77,50.74 24.77,50.26 25.52,49.5 v26,49.5 | C1.2 18.35,44.9 18.25,45
  Bottom 0.4: RGB4.3 32.54,35.5 29,35.5 | 4.04,35.5 RGB1.3 | 29,35.5 23,35.5 | 23,35.5 19.25,35.5 | 19.25,35.5 15.5,35.5 | 15.5,35.5 v15,35.5 13.5,35.5 | 13.5,35.5 6,35.5 | 6,35.5 4.04,35.5 | C12.1 29,35.5 | RGB3.3 23.04,35.5 23,35.5 | C11.1 19.5,35.5 19.25,35.5 | C10.1 15.5,35.5 | RGB2.3 13.54,35.5 13.5,35.5 | C9.1 6,35.5 | RGB5.3 4.04,45 | RGB8.3 32.54,45 29,45 | 4.04,45 6,45 | 6,45 13.5,45 | 13.5,45 15.5,45 | 15.5,45 18.25,45 19.5,45 | 19.5,45 23,45 | 23,45 v27.75,45 29,45 | RGB7.3 23.04,45 23,45 | C16.1 v29,45.75 29,45 | C15.1 19.5,45 | C14.1 15.5,45 | RGB6.3 13.54,45 13.5,45 | C13.1 6,45 | RGB9.3 4.04,54.5 | 23.04,54.5 RGB11.3 | 4.04,54.5 6,54.5 | 6,54.5 7.75,54.5 13,54.5 13.5,54.5 | 13.5,54.5 14.75,54.5 15.5,54.5 | 15.5,54.5 16.5,54.5 18.25,54.5 19.5,54.5 | 19.5,54.5 23.04,54.5 | C19.1 19.5,54.5 | C18.1 15.5,54.5 | RGB10.3 13.5,55.61 13.5,54.5 | C17.1 6,54.5 | 23.04,54.5 24.5,54.5 24.75,54.75 26.4,56.4 C20.1 30.13,55.02 30.13,54.73 30.32,54.53 30.75,54.53 31.59,54.53 31.79,54.73 31.79,54.86 RGB12.3 33.25,56.32 v33.25,57 | RGB13.3 4.04,64 | RGB16.3 32.54,64 29.25,64 29,64 | 4.04,64 6,64 | 6,64 13.5,64 | 13.5,64 15.5,64 | 15.5,64 19.5,64 | 19.5,64 v20.25,64 23,64 | 23,64 29,64 | C24.1 29,64 | RGB15.3 23.04,64 23,64 | C23.1 19.5,64 | C22.1 15.5,64 | RGB14.3 13.54,64 13.5,64 | C21.1 6,64 | 4.04,35.5 v1,35.5 | 4.04,64 v0.95,64 | 4.04,54.5 v0.95,54.5 | 4.04,45 v3.25,45 v0.95,45
GND-4  (via drill 0.3)
  Top 0.4: v35.95,29 v35.95,19.5 v35.95,10 v35.95,0.5 | RX-3.1 v54.25,29
  Bottom 0.4: 41,0.5 39.25,0.5 39,0.5 | 41,0.5 48.5,0.5 | 48.5,0.5 50.5,0.5 | 50.5,0.5 54.5,0.5 | 54.5,0.5 58,0.5 | 58,0.5 64,0.5 | 64,0.5 67.5,0.5 67.54,0.54 RGB20.3 | RGB19.3 58,1.57 58,0.5 | C28.1 64,0.5 | C27.1 54.5,0.5 | C26.1 50.5,0.5 | RGB18.3 48.5,1.57 48.5,0.5 | C25.1 41,0.5 | RGB21.3 39,11.07 39,10 | 39,10 41,10 | 41,10 48.5,10 | 48.5,10 50.5,10 | 50.5,10 54.5,10 | 54.5,10 58,10 | 58,10 58.25,10 59.5,8.75 63.2,8.75 C32.1 64.15,9.4 66.25,7.3 67.25,7.3 67.95,8 67.95,9 67.06,9.89 67.06,10.24 66.97,10.33 RGB24.3 | RGB23.3 58,11.07 58,10 | RGB22.3 48.54,10.04 48.5,10 | C31.1 54.5,10 | C30.1 50.5,10 | C29.1 41,10 | 48.5,19.5 50.5,19.5 | 50.5,19.5 54.5,19.5 | 54.5,19.5 58,19.5 | RGB27.3 58,20.57 58,19.5 | RGB26.3 48.5,20.57 48.5,19.5 | C34.1 50.5,19.5 | C35.1 54.5,19.5 | 58,19.5 62.87,19.5 RGB28.3 65.25,21.88 65.25,22.5 63.35,24.4 C36.1 | 41,29 39.25,29 39,29 | 41,29 48.5,29 | 48.5,29 50.5,29 | 50.5,29 v54.25,29 54.5,29 | 54.5,29 58,29 | 58,29 64,29 | 64,29 67.5,29 67.5,30.07 RGB32.3 | RGB31.3 58.04,29.04 58,29 | C37.1 64,29 | C38.1 54.5,29 | C39.1 50.5,29 | RGB30.3 48.5,30.07 48.5,29 | C40.1 41,29 | RGB17.3 39.04,0.54 39,0.5 | v35.95,29 39,29 | RGB29.3 39,30.07 39,29 | 48.5,19.5 41,19.5 | 41,19.5 39,19.5 | 39,19.5 v35.95,19.5 | RGB25.3 39,20.57 39,19.5 | 39,10 v35.95,10 | 39,0.5 v35.95,0.5 | C33.1 41,19.5
GPIO0-1  (via drill 0.3)
  Top 0.127: T1.C v54.25,60.81 | v41.28,60.81 41.28,56.03 40.5,55.25 GPIO0-1.1
  Bottom 0.127: v54.25,60.81 54.09,60.64 41.45,60.64 v41.28,60.81
GPIO0-3  (via drill 0.3)
  Top 0.127: v20,52.47 20.47,52 22.5,52 23.95,50.55 U1.GPIO0 27.3,50.55 27.5,50.75 27.5,51.5 27.76,51.76 28.17,51.76 28.18,51.75 28.25,51.75 29.08,50.92 32.92,50.92 33.25,51.25 v33.25,54.5 33.25,55 33,55.25 GPIO0-2.1
  Bottom 0.127: R4.2 v20,52.47 | S1.1 23.25,61.6 23.25,60.75 23.36,60.64 29.52,60.64 30.08,60.08 32.87,60.08 33.23,59.72 33.23,58.52 33.67,58.08 33.67,56.18 33.25,55.77 v33.25,54.5
GPIO2  (via drill 0.3)
  Top 0.127: U1.GPIO2 23.7,48.55 23.25,49 23.25,50.89 22.39,51.75 20.1,51.75 18.97,51.75 v18.25,52.47
  Bottom 0.127: R5.2 v18.25,52.47
GPIO4  (via drill 0.3)
  Top 0.127: v27.5,55.5 28.25,55.5 28.5,55.25 28.5,52.75 28.3,52.55 U1.GPIO4 21.83,52.55 v21.75,52.47
  Bottom 0.127: R9.1 v21.75,52.47 | ADXL345.13 26.86,54.86 v27.5,55.5
GPIO5  (via drill 0.3)
  Top 0.127: v16.5,52.47 17.03,53 22.25,53 23.8,54.55 U1.GPIO5 27.7,54.55 28,54.25 v28,53.5
  Bottom 0.127: R8.1 v16.5,52.47 | ADXL345.14 v28,53.5
GPIO12-2  (via drill 0.3)
  Top 0.127: IC1.6 26.5,10.89 v26.5,9.45 | v18,9 18,14.15 R10.1 17.75,14.78 18.49,15.52 18.49,19.24 19.02,19.77 19.02,21.11 19.54,21.63 19.54,24.61 19.57,24.63 19.57,25.42 18.5,26.48 VCC-USB-17.1
  Bottom 0.127: v26.5,9.45 26.08,9.03 25.08,9.03 24.91,9.19 20.59,9.19 20.42,9.03 18.03,9.03 v18,9
GPIO12-3
  Top 0.127: U1.GPIO12 16.7,48.55 17.75,47.5 17.75,40.75 18.5,40 VCC-USB-23.1
GPIO13  (via drill 0.3)
  Top 0.127: v2.5,37.75 4.25,37.75 5.25,38.75 5.25,45.75 6.05,46.55 U1.GPIO13
  Bottom 0.127: RGB1.4 2.5,36.65 v2.5,37.75
GPIO15  (via drill 0.3)
  Top 0.127: U1.GPIO15 23.55,46.55 23.5,46.5 22.99,47.01 22.99,50.79 22.29,51.49 15.73,51.49 v14.75,52.47
  Bottom 0.127: R1.2 v14.75,52.47
INT1-2  (via drill 0.3)
  Top 0.127: VCC-USB-12.1 22,30 22.21,29.79 22.21,25.07 21.73,24.59 21.73,20.44 IC2.9 IC2.8 20.19,18.94 19.67,18.42 19.67,6.72 v19.5,6.55 | IC3.1 12.85,6.7 v13,6.55
  Bottom 0.127: v13,6.55 13.16,6.39 19.34,6.39 v19.5,6.55
INT1-3  (via drill 0.3)
  Top 0.127: VCC-USB-22.1 23.25,38.5 23.75,39 23.75,42.75 24.5,43.5 27.25,43.5 28.25,44.5 28.25,48.75 27.68,49.32 v27.58,49.32
  Bottom 0.127: ADXL345.8 27.32,50.5 27.32,49.58 v27.58,49.32
N$1
  Bottom 0.127: RGB2.4 11.36,36.61 10.64,35.89 7.11,35.89 6.75,36.25 6.75,37.97 6.47,38.25 5.53,38.25 5.31,38.47 5.31,39.69 5.11,39.89 RGB1.2
N$2  (via drill 0.3)
  Top 0.127: CH340C.2 51.58,51.49 v51.5,51.56 | v46.5,52 R18.2
  Bottom 0.127: v51.5,51.56 50.64,51.56 50.48,51.72 50.13,51.72 49.55,51.14 47,51.14 46.5,51.64 v46.5,52
N$3
  Bottom 0.127: R6.1 24.51,50.64 24.51,50.15 25.77,48.89 27.75,48.89 28,49.14 28,49.5 ADXL345.7
N$4
  Bottom 0.127: R7.1 26.11,52.51 26.11,53.23 26.22,53.34 26.5,53.34 26.86,53.34 ADXL345.12
N$5
  Top 0.127: USB-C.10 59.5,54.25 59,54.75 R13.2
N$6  (via drill 0.3)
  Top 0.127: IC1.3 21.5,10.93 | 21.5,10.93 IC1.2 | IC3.4 12.99,10.94 12.57,10.94 12.43,10.8 v12.43,8.5 | v21.25,6.85 21.5,7.1 21.5,10.93
  Bottom 0.127: v12.43,8.5 13.75,8.5 14.01,8.24 14.01,7.12 14.12,7.01 15.24,7.01 15.25,7 17,7 17.5,7.5 19.75,7.5 20.25,7 21.1,7 v21.25,6.85
N$7
  Top 0.127: USB-C.4 63,51.25 62.5,51.75 62.5,53.5 62,54 57.75,54 57.25,54.49 R22.2
N$8  (2 unrouted)
N$9  (via drill 0.3)
  Top 0.127: v9.25,17.5 9.25,18.53 TP4056X.7
  Bottom 0.127: D2.C 9,17 9.25,17.25 v9.25,17.5
N$10  (via drill 0.3)
  Top 0.127: v8.54,18.95 8.4,18.95 TP4056X.6
  Bottom 0.127: D3.C 8.5,18.91 v8.54,18.95
N$11
  Top 0.127: TP4056X.2 9.34,24.25 10.08,23.51 11,23.51 11.1,23.61 15.64,23.61 16,23.25 R15.2
N$12
  Bottom 0.127: D2.A 10.5,17 10.76,16.74 10.76,16.32 10.87,16.21 12.13,16.21 12.24,16.32 12.24,16.49 12.65,16.9 R16.1
N$13
  Bottom 0.127: R17.1 10.75,17.65 10.75,18 10.5,18.25 D3.A
N$14  (via drill 0.3)
  Top 0.127: CH340C.3 52.84,51.47 v52.75,51.56 | v48.25,52 R19.2
  Bottom 0.127: v52.75,51.56 52.09,51.56 51.67,51.98 48.27,51.98 v48.25,52
N$15  (via drill 0.3, 0.35)  (1 unrouted)
  Top 0.127: v11,5.5 VBAT.1 | TP4056X.5 6.73,19.99 6.66,20.06 6.66,22.81 v6.85,23.01 | C6.2 12.5,21.86 v12.63,21.73
  Top 0.4: TP4056X.5 6.73,12.67 Q1.3 8.15,6.35 9,5.5 VBAT.1
  Bottom 0.127: 11,6.25 v11,5.5 | v6.85,23.01 6.85,22.9 6.88,22.88 8,21.75 12.61,21.75 v12.63,21.73
N$16
  Top 0.127: R20.1 48.85,56.5 49.85,56.5 50.11,56.25 53,56.25 53.3,55.95 T1.B
N$17
  Bottom 0.127: RGB4.2 31.35,41.08 31.35,41.16 31.12,41.39 3.61,41.39 0.5,44.5 0.5,45.5 1.11,46.11 RGB5.4
N$18
  Bottom 0.127: RGB2.2 13.68,39.75 14.5,39.75 14.81,39.44 14.81,38.44 15,38.25 15.5,38.25 19.97,38.25 20.19,38.03 20.19,37 20.58,36.61 RGB3.4
N$19
  Top 0.127: T2.B 50.05,55.95 49.75,56.25 46.75,56.25 46.5,56.5 R21.1
N$20
  Bottom 0.127: RGB3.2 23.64,39.89 23.75,40 24.36,40.61 27.75,40.61 28.25,40.11 28.25,39.25 28.25,38.5 28.5,38.25 29.47,38.25 29.69,38.03 29.69,37.06 30.14,36.61 RGB4.4
N$21
  Bottom 0.127: RGB5.2 4.86,49.39 5.25,49 5.25,48 5.5,47.75 6.47,47.75 6.69,47.53 6.69,45.56 6.86,45.39 10.39,45.39 11.11,46.11 RGB6.4
N$22
  Bottom 0.127: RGB6.2 14.36,49.39 14.81,48.94 14.81,48.5 14.81,47.94 15,47.75 19.97,47.75 20.19,47.53 20.19,46.56 20.64,46.11 RGB7.4
N$23
  Bottom 0.127: RGB8.4 30.08,46.11 29.69,46.5 29.69,47.53 29.47,47.75 28.21,47.75 28.1,47.86 24.57,47.86 RGB7.2
N$24
  Bottom 0.127: RGB8.2 32.48,49.39 31.54,50.33 30.18,50.33 29.24,49.39 28.47,49.39 28.31,49.23 28.31,48.95 28,48.64 25.66,48.64 24.26,50.05 24.26,50.44 23.8,50.89 3.25,50.89 | 3.25,50.89 3.19,50.95 | 3.19,50.95 3.25,50.89 | RGB9.4 0.86,55.61 0.5,55.25 0.5,53.64 3.19,50.95
N$25
  Bottom 0.127: RGB9.2 4.86,58.89 5.31,58.44 5.31,57.44 5.5,57.25 6.47,57.25 6.69,57.03 6.69,55.06 6.86,54.89 10.64,54.89 11.36,55.61 RGB10.4
N$26
  Bottom 0.127: RGB10.2 13.65,59 14.5,59 14.81,58.69 14.81,57.44 15,57.25 19.97,57.25 20.19,57.03 20.19,56 20.58,55.61 RGB11.4
N$27
  Bottom 0.127: RGB11.2 23.64,58.89 24.36,59.61 27.5,59.61 28,59.11 28,57.5 28.25,57.25 29.25,57.25 29.5,57 29.5,56.25 30.14,55.61 RGB12.4
N$28
  Bottom 0.127: RGB12.2 31.86,58.89 31.75,59 31.75,59.62 31.54,59.83 29.97,59.83 29.41,60.39 2.85,60.39 2.19,61.06 0.5,62.75 0.5,64.25 1.36,65.11 RGB13.4
N$29
  Bottom 0.127: RGB13.2 4.18,68.25 5,68.25 5.31,67.94 5.31,66.94 5.5,66.75 6.47,66.75 6.69,66.53 6.69,64.56 6.86,64.39 10.64,64.39 11.36,65.11 RGB14.4
N$30
  Bottom 0.127: RGB14.2 13.65,68.5 14.5,68.5 14.81,68.19 14.81,66.94 15,66.75 19.97,66.75 20.19,66.53 20.19,65.5 20.58,65.11 RGB15.4
N$31
  Bottom 0.127: RGB15.2 23.64,68.39 24.36,69.11 27.89,69.11 28.25,68.75 28.25,67 28.5,66.75 29.47,66.75 29.69,66.53 29.69,65.5 30.08,65.11 RGB16.4
N$32
  Bottom 0.127: RGB20.2 66.04,6.39 36.86,6.39 35.53,7.72 35.53,10.28 36.36,11.11 RGB21.4
N$33
  Bottom 0.127: RGB17.2 39.61,4.89 40.31,4.19 40.31,3.44 40.5,3.25 41.47,3.25 41.75,2.97 41.75,1.25 42.11,0.89 45.64,0.89 46.36,1.61 RGB18.4
N$34
  Bottom 0.127: RGB18.2 49.11,4.89 49.81,4.19 49.81,3.47 50.03,3.25 54.97,3.25 55.25,2.97 55.25,2 55.64,1.61 RGB19.4
N$35
  Bottom 0.127: RGB19.2 58.64,4.89 59.36,5.61 62.64,5.61 63.25,5 63.25,3.53 63.53,3.25 64.47,3.25 64.75,2.97 64.75,2 65.14,1.61 RGB20.4
N$36
  Bottom 0.127: RGB21.2 39.61,14.39 40.25,13.75 40.25,13.03 40.53,12.75 41.47,12.75 41.75,12.47 41.75,10.75 42.11,10.39 45.64,10.39 46.36,11.11 RGB22.4
N$37
  Bottom 0.127: RGB22.2 49.11,14.39 49.81,13.69 49.81,12.97 50.03,12.75 54.97,12.75 55.25,12.47 55.25,11.5 55.64,11.11 RGB23.4
N$38
  Bottom 0.127: RGB23.2 58.64,14.39 59.36,15.11 59.75,15.11 60.47,15.11 61.54,14.04 62.25,13.33 62.25,11.25 61.72,10.71 61.72,10.56 62.6,9.67 63.07,9.67 63.74,10.33 63.92,10.33 64.5,9.75 65.32,9.75 RGB24.4
N$39
  Bottom 0.127: RGB24.2 63.87,14.5 62.19,14.5 60.8,15.89 56.5,15.89 36.86,15.89 35.5,17.25 35.5,20 36.11,20.61 RGB25.4
N$40
  Bottom 0.127: RGB25.2 39.61,23.89 40.25,23.25 40.25,22.5 40.5,22.25 41,22.25 41.5,22.25 41.75,22 41.75,20.25 42.11,19.89 45.64,19.89 46.36,20.61 RGB26.4
N$41
  Bottom 0.127: RGB26.2 49.11,23.89 49.75,23.25 49.75,22.5 50,22.25 54.97,22.25 55.25,21.97 55.25,21 55.64,20.61 RGB27.4
N$42
  Bottom 0.127: RGB27.2 58.64,23.89 59.36,24.61 61.39,24.61 63.53,22.47 RGB28.4
N$43
  Bottom 0.127: RGB28.2 66.97,25.21 67.81,26.06 67.81,26.94 67.19,27.56 64.01,27.56 61.84,25.39 36.86,25.39 35.5,26.75 35.5,29.5 36.11,30.11 RGB29.4
N$44
  Bottom 0.127: RGB29.2 39.61,33.39 40.31,32.69 40.31,31.94 40.5,31.75 41.47,31.75 41.75,31.47 41.75,29.75 42.11,29.39 45.64,29.39 46.36,30.11 RGB30.4
N$45
  Bottom 0.127: RGB30.2 49.11,33.39 49.81,32.69 49.81,31.94 50,31.75 50.75,31.75 54.97,31.75 55.25,31.47 55.25,30.5 55.64,30.11 RGB31.4
N$46
  Bottom 0.127: RGB31.2 58.64,33.39 59.36,34.11 62.64,34.11 63.25,33.5 63.25,32 63.5,31.75 64.47,31.75 64.69,31.53 64.69,30.5 65.08,30.11 RGB32.4
N$47
  Bottom 0.127: RGB36.2 66.35,41.08 66.35,41.16 66.12,41.39 37.11,41.39 35.5,43 35.5,45.25 36.36,46.11 RGB37.4
N$48
  Bottom 0.127: RGB33.2 39.86,39.89 40.31,39.44 40.31,39 40.31,38.44 40.5,38.25 41.47,38.25 41.69,38.03 41.69,37.25 41.69,36.31 42.11,35.89 45.64,35.89 46.36,36.61 RGB34.4
N$49
  Bottom 0.127: RGB34.2 49.36,39.89 49.81,39.44 49.81,38.44 50,38.25 54.97,38.25 55.19,38.03 55.19,37.06 55.64,36.61 RGB35.4
N$50
  Bottom 0.127: RGB35.2 58.64,39.89 59.36,40.61 62.89,40.61 63.25,40.25 63.25,38.5 63.5,38.25 64.47,38.25 64.69,38.03 64.69,37 65.08,36.61 RGB36.4
N$51
  Bottom 0.127: RGB37.2 40.11,49.39 40.31,49.19 40.31,47.97 40.5,47.78 40.5,47.75 41.47,47.75 41.69,47.53 41.69,45.56 41.86,45.39 45.64,45.39 46.36,46.11 RGB38.4
N$52
  Bottom 0.127: RGB38.2 49.61,49.39 49.81,49.19 49.81,47.94 50,47.75 54.97,47.75 55.19,47.53 55.19,46.5 55.58,46.11 RGB39.4
N$53
  Bottom 0.127: RGB39.2 58.64,49.39 59.36,50.11 62,50.11 62.36,49.75 62.36,49 62.36,47.14 63.5,46 65.25,46 65.61,46.36 RGB40.4
N$54
  Bottom 0.127: RGB40.2 66.54,50.89 37.61,50.89 35.5,53 35.5,54.64 36.47,55.61 RGB41.4
N$55
  Bottom 0.127: RGB41.2 39.86,58.89 40.31,58.44 40.31,57.75 40.31,57.44 40.5,57.25 41.47,57.25 41.69,57.03 41.69,56.25 41.69,55.31 42.11,54.89 45.64,54.89 46.36,55.61 RGB42.4
N$56
  Bottom 0.127: RGB42.2 49.36,58.89 49.81,58.44 49.81,57.44 50,57.25 54.97,57.25 55.19,57.03 55.19,56 55.58,55.61 RGB43.4
N$57
  Bottom 0.127: RGB43.2 63.67,58.89 | 63.67,58.89 | 63.67,58.89 64.83,58.89 64.94,58.78 64.94,58.25 66.21,56.98 RGB44.4
N$58
  Bottom 0.127: RGB44.2 66.6,59.83 66.6,60.01 66.02,60.59 63.67,60.59 63.47,60.39 37.25,60.39 35.53,62.11 35.53,64.17 36.47,65.11 RGB45.4
N$59
  Bottom 0.127: RGB45.2 39.86,68.39 40.31,67.94 40.31,66.97 40.5,66.78 40.5,66.75 41.47,66.75 41.69,66.53 41.69,64.81 42.11,64.39 45.64,64.39 46.36,65.11 RGB46.4
N$60
  Bottom 0.127: RGB46.2 49.36,68.39 49.81,67.94 49.81,67.25 49.81,66.94 50,66.75 54.97,66.75 55.19,66.53 55.19,65.5 55.58,65.11 RGB47.4
N$61
  Bottom 0.127: RGB47.2 58.64,68.39 59.36,69.11 63,69.11 63.25,68.86 63.25,67.5 63.25,67 63.5,66.75 64.47,66.75 64.69,66.53 64.69,65.75 65.33,65.11 RGB48.4
N$62
  Bottom 0.127: RGB52.2 32.5,4.93 32.5,5.75 31.86,6.39 20.25,6.39 19.67,6.97 19.33,6.97 19,6.64 13.86,6.64 12.76,7.74 11.52,7.74 10.3,8.96 6.79,8.96 6.75,9 5.67,9 5.43,8.76 5.01,8.76 3.69,7.44 2.81,7.44 0.53,9.72 0.53,10.17 0.77,10.42 1.77,10.42 RGB53.4
N$63
  Bottom 0.127: RGB49.2 5.31,3.62 5.31,3.47 5.53,3.25 6.47,3.25 6.75,2.97 6.75,1.25 7.11,0.89 10.64,0.89 11.25,1.5 11.85,1.5 RGB50.4
N$64
  Bottom 0.127: RGB50.2 13.68,4.75 14.5,4.75 14.75,4.5 14.75,3.53 15.03,3.25 15.5,3.25 16,3.25 20,3.25 20.25,3 20.25,2 20.64,1.61 RGB51.4
N$65
  Bottom 0.127: RGB51.2 23.64,4.89 24.36,5.61 28,5.61 28.25,5.36 28.25,4 28.25,3.5 28.5,3.25 29.47,3.25 29.69,3.03 29.69,2.25 30.33,1.61 RGB52.4
N$66
  Bottom 0.127: RGB53.2 4.61,14.39 4.75,14.25 5.25,13.75 5.25,13.03 5.53,12.75 6.47,12.75 6.75,12.47 6.75,10.75 7.11,10.39 7.75,10.39 10.64,10.39 11.25,11 11.85,11 RGB54.4
N$67
  Bottom 0.127: RGB54.2 13.68,14.25 14.25,14.25 14.75,13.75 14.75,13.03 15.03,12.75 19.97,12.75 20.25,12.47 20.25,11.5 20.64,11.11 RGB55.4
N$68
  Bottom 0.127: RGB55.2 23.15,14.5 23.75,14.5 24.36,15.11 27.75,15.11 28.25,14.61 28.25,13 28.5,12.75 29.47,12.75 29.75,12.47 29.75,11.5 30.14,11.11 RGB56.4
N$69
  Bottom 0.127: RGB56.2 31.35,15.58 31.35,16.49 29.92,17.92 29.58,17.92 28.08,16.42 26.75,16.42 26.17,17 25.83,17 25.5,16.67 19.5,16.67 19.17,17 18.83,17 18.5,16.67 16.92,16.67 16.17,17.42 14.83,17.42 14.33,16.92 14.33,16.08 14.14,15.89 11.45,15.89 11.42,15.92 11.08,15.92 11.05,15.89 1.86,15.89 0.5,17.25 0.5,20.25 0.86,20.61 RGB57.4
N$70
  Bottom 0.127: RGB57.2 4.18,23.75 4.75,23.75 5.25,23.25 5.25,22.5 5.5,22.25 6.47,22.25 6.75,21.97 6.75,20.25 7.11,19.89 10.64,19.89 11.36,20.61 RGB58.4
N$71
  Bottom 0.127: RGB58.2 14.11,23.89 14.81,23.19 14.81,23 14.81,22.44 15,22.25 20,22.25 20.25,22 20.25,21 20.64,20.61 RGB59.4
N$72
  Bottom 0.127: RGB59.2 23.64,23.89 24.36,24.61 27.75,24.61 28.25,24.11 28.25,22.5 28.5,22.25 29.47,22.25 29.75,21.97 29.75,21 30.14,20.61 RGB60.4
N$73
  Bottom 0.127: RGB60.2 31.35,25.08 31.35,25.16 31.12,25.39 19.55,25.39 18.92,26.02 13.13,26.02 12.5,25.39 1.7,25.39 1.67,25.42 1.58,25.42 0.5,26.5 0.5,29.5 1.11,30.11 RGB61.4
N$74
  Bottom 0.127: RGB61.2 4.18,33.25 4.75,33.25 5.25,32.75 5.25,32 5.5,31.75 6.47,31.75 6.75,31.47 6.75,29.75 7.11,29.39 10.5,29.39 11.22,30.11 RGB62.4
N$75
  Bottom 0.127: RGB62.2 14.11,33.39 14.81,32.69 14.81,31.94 15,31.75 19.97,31.75 20.19,31.53 20.19,30.5 20.58,30.11 RGB63.4
N$76
  Bottom 0.127: RGB63.2 23.64,33.39 24.36,34.11 27.64,34.11 28.25,33.5 28.25,32 28.5,31.75 29.47,31.75 29.75,31.47 29.75,30.5 30.14,30.11 RGB64.4
N$77  (via drill 0.3)
  Top 0.127: CH340C.4 54.25,47.17 v54.25,44.45 | v44.75,44.45 C73.1
  Bottom 0.127: v54.25,44.45 54.09,44.61 44.91,44.61 v44.75,44.45
N$78  (via drill 0.3)
  Top 0.127: C74.1 R3.2 v15.5,9.45 | v13.5,9.45 IC3.2
  Bottom 0.127: v15.5,9.45 15.05,9.45 14.92,9.57 14.58,9.57 14.45,9.45 v13.5,9.45
N$79  (via drill 0.3)
  Top 0.127: R27.1 v16,17 | v26,16.58 26.05,16.58 IC1.9 | v17,8 17.58,8.58 18.17,8.58 18.42,8.83 18.42,9.17 18.25,9.34 18.25,13.59 18.49,13.82 18.49,14.49 18.5,14.5 18.5,15.17 18.74,15.42 18.74,16.32 v19,16.58
  Bottom 0.127: v16,17 16.58,16.42 19,16.42 | v26,16.58 25.84,16.42 19,16.42 | S3.2 v17,8 | v19,16.58 19,16.42
N$80  (via drill 0.3)
  Top 0.127: IC1.5 25.27,9.47 v25.25,9.45 | v20.25,9.45 20.19,9.51 IC1.1
  Bottom 0.127: v25.25,9.45 v20.25,9.45
N$81
  Top 0.127: IC1.12 IC1.11 IC1.10
N$82  (via drill 0.3)
  Top 0.127: IC1.4 v24,12.5 | v27.75,12.5 27.81,12.56 IC1.8
  Bottom 0.127: v24,12.5 v27.75,12.5
N$83  (via drill 0.3)
  Top 0.127: IC2.1 27.81,28.39 v27.75,28.45 | v21.5,28 21.46,27.96 IC2.6
  Bottom 0.127: v27.75,28.45 24.59,28.45 24.17,28.03 23.83,28.03 23.66,28.19 21.69,28.19 v21.5,28
N$84
  Top 0.127: IC1.13 21.46,18.56 21.98,19.08 21.98,24.48 22.73,25.23 IC2.5
N$85  (via drill 0.3)
  Top 0.127: IC2.10 22.73,18.69 21.98,17.94 21.98,13.27 v22,13.25 | v14.75,9.15 14.75,10.97 14.87,11.09 15.09,11.09 15.5,11.5 R3.1 | v20.75,13.25 20.75,9.28 v20.09,8.61
  Bottom 0.127: v20.09,8.61 18.25,8.61 | 18.25,8.61 18.2,8.61 | 18.25,8.61 18.2,8.61 | 18.2,8.61 18.17,8.58 16.99,8.58 16.58,8.99 15.18,8.99 15.02,9.15 v14.75,9.15 | v22,13.25 v20.75,13.25
N$86  (1 unrouted)
RST-PIN-2  (via drill 0.3)
  Top 0.127: v20.61,28.45 20.61,28.77 20.67,28.83 20.67,31.08 VCC-USB-18.1 | v24,28.45 IC2.4
  Bottom 0.127: v20.61,28.45 v24,28.45
RST-PIN-3
  Top 0.127: VCC-USB-24.1 19.75,39 19.75,43.77 18,45.52 18,47.61 16.8,48.8 14.75,48.8 13.75,49.8 13.75,52.31 11.75,54.31 11.75,58 11.2,58.55 U1.RESET
RST-SIG-1
  Top 0.127: T2.C 52.57,57.35 53.99,55.93 53.99,55.01 54,55 53.99,54.99 53.99,54.37 53.35,53.73 53.35,40.9 54.25,40 RST-SIG-1.1
RST-SIG-2  (via drill 0.3)
  Top 0.127: VCC-USB-16.1 30.75,16.5 29,16.5 28.5,17 28.5,24.25 28,24.75 26.75,24.75 26.54,24.96 IC2.2 IC2.3 v24.75,25.81 | v17.75,26.44 R24.2
  Bottom 0.127: v24.75,25.81 24.59,25.64 19.66,25.64 19.03,26.28 17.91,26.28 v17.75,26.44
RTS
  Top 0.127: CH340C.14 52.84,53.66 52.5,54 52.25,54 52,54.25 | 52,54.25 51.95,54.3 T2.E | R20.2 49.4,54.25 52,54.25
RX-1  (via drill 0.3)
  Top 0.127: RX-1.1 40.5,51.75 41,52.25 41,53.63 v41.06,53.69 | v45.5,53 45.65,52.85 R18.1
  Bottom 0.127: v41.06,53.69 41.23,53.86 45,53.86 45.5,53.36 v45.5,53
RX-3
  Top 0.127: U1.RXD0 27.56,56.55 28.75,55.36 28.75,52.64 28.75,52 29,51.75 GND-2.1
TX-1  (via drill 0.3)
  Top 0.127: TX-1.1 40.05,53.5 v40.5,53.95 | v48.25,53.69 R19.1
  Bottom 0.127: v40.5,53.95 40.66,54.11 45.75,54.11 46.33,53.53 46.67,53.53 46.84,53.69 v48.25,53.69
TX-3
  Top 0.127: U1.TXD0 25.65,58.5 27.5,58.5 29.01,56.99 29.01,53.75 29.26,53.5 RST-SIG-2.1
VBAT  (1 unrouted)
  Top 0.127: C8.1 C7.1
VBAT-1  (via drill 0.3)
  Top 0.4: v40.25,50.47 38.97,50.47 VCC-USB-1.1 36.5,50 | v36.5,41 36.5,50 | 36.5,50 v36.5,50.5 v36.5,60 v36.5,69.5
  Bottom 0.4: RGB33.1 37.46,41 | RGB36.1 65.96,41 64,41 | 37.46,41 41,41 | 41,41 47,41 | 47,41 50.5,41 | 50.5,41 54.5,41 | 54.5,41 56.5,41 | 56.5,41 64,41 | C44.2 64,41 | RGB35.1 56.46,41 56.5,41 | C43.2 54.5,41 | C42.2 50.5,41 | RGB34.1 46.96,41 47,41 | C41.2 41,41 | RGB37.1 37.46,50.5 | 56.46,50.5 RGB39.1 | 37.46,50.5 40.25,50.5 | 40.25,50.5 41,50.5 | 41,50.5 47,50.5 | 47,50.5 50.5,50.5 | 50.5,50.5 54.5,50.5 | 54.5,50.5 56.46,50.5 | C47.2 54.5,50.5 | C46.2 50.5,50.5 | RGB38.1 46.96,50.5 47,50.5 | C45.2 41,50.5 | RGB40.1 66.21,50.5 62.75,50.5 | 56.46,50.5 62.75,50.5 | C48.2 63.4,46.85 62.75,47.5 62.75,50.5 | RGB41.1 37.46,60 | 56.46,60 RGB43.1 | 37.46,60 41,60 | 41,60 47,60 | 47,60 50.5,60 | 50.5,60 54.5,60 | 54.5,60 56.46,60 | C51.2 54.5,60 | C50.2 50.5,60 | RGB42.1 47,58.89 47,60 | C49.2 41,60 | 56.46,60 64.25,60 C52.2 66.21,59.85 RGB44.1 | RGB45.1 37.46,69.5 | RGB48.1 65.96,69.5 64,69.5 | 37.46,69.5 41,69.5 | 41,69.5 47,69.5 | 47,69.5 50.5,69.5 | 50.5,69.5 54.5,69.5 | 54.5,69.5 56.5,69.5 | 56.5,69.5 64,69.5 | C56.2 64,69.5 | RGB47.1 56.5,68.39 56.5,69.5 | C55.2 54.5,69.5 | C54.2 50.5,69.5 | RGB46.1 46.96,69.5 47,69.5 | C53.2 41,69.5 | v40.25,50.47 40.25,50.5 | 37.46,41 v36.5,41 | v36.5,69.5 37.46,69.5 | 37.46,60 v36.5,60 | 37.46,50.5 v36.5,50.5
VBAT-2  (via drill 0.3)
  Top 0.127: C2.1 13.46,19.61 14.83,19.61 14.94,19.72 14.94,20.19 15.45,20.7 NCP114.3
  Top 0.4: v1.5,6 v1.5,15.5 v1.5,25 1.5,29.29 1.47,29.32 1.47,30.98 1.5,31.01 v1.5,34.5 | D1.C 10.22,15.5 v11.25,15.5 | Q1.2 10.35,13.1 v10.5,13.25 | NCP114.3 16.32,20.97 16.32,21.34 16.52,21.53 17.25,21.53 17.48,21.53 17.68,21.34 17.68,20.97 NCP114.1 17.95,21.34 18.63,22.02 v18.63,25.02 v18.62,25.03 | VCC2.1 v16.75,34.5 | VCC3.1 v17.5,5.97
  Bottom 0.4: RGB49.1 2.5,4.93 2.5,6 | 2.5,6 4.64,6 4.87,5.77 4.87,5.23 C57.2 6.79,4.89 RGB50.1 12,4.93 12,6 15.5,6 | 15.5,6 17.5,6 | 17.5,6 19.5,6 | 19.5,6 21.5,6 | 21.5,6 29,6 | RGB51.1 21.5,4.93 21.5,6 | C58.2 15.5,6 | C59.2 19.5,6 | C60.2 29,6 | RGB53.1 2.46,15.46 | 2.46,15.46 2.5,15.5 6,15.5 | 6,15.5 v11.25,15.5 12,15.5 | 12,15.5 15.5,15.5 | 15.5,15.5 19.5,15.5 | 19.5,15.5 21.5,15.5 | 21.5,15.5 29,15.5 | RGB55.1 21.46,15.46 21.5,15.5 | C63.2 19.5,15.5 | C62.2 15.5,15.5 | 12,15.5 11.96,15.46 RGB54.1 11.96,13.46 11.75,13.25 v10.5,13.25 | C61.2 6,15.5 | C64.2 29,15.5 | RGB57.1 2.5,23.93 2.5,25 | 2.5,25 6,25 | 6,25 8,25 12,25 | 12,25 15.5,25 | 15.5,25 18.75,25 | 18.75,25 19.5,25 | 19.5,25 21.5,25 | 21.5,25 29,25 | C68.2 29,25 | RGB59.1 21.5,23.93 21.5,25 | C67.2 19.5,25 | C66.2 15.5,25 | RGB58.1 12,23.93 12,25 | C65.2 6,25 | RGB61.1 2.5,33.39 2.5,34.5 | 2.5,34.5 6,34.5 | 6,34.5 12,34.5 | 12,34.5 15.5,34.5 | 15.5,34.5 v16.75,34.5 19.5,34.5 | 19.5,34.5 21.5,34.5 | 21.5,34.5 29,34.5 | 29,34.5 30.96,34.5 RGB64.1 | RGB63.1 21.46,34.5 21.5,34.5 | C72.2 29,34.5 | C71.2 19.5,34.5 | C70.2 15.5,34.5 | RGB62.1 11.96,34.5 12,34.5 | C69.2 6,34.5 | RGB52.1 30.96,6 29,6 | RGB56.1 30.96,15.5 29,15.5 | RGB60.1 30.96,25 29,25 | 2.5,6 v1.5,6 | v1.5,34.5 2.5,34.5 | 2.5,25 v1.5,25 | 2.46,15.46 2.42,15.5 v1.5,15.5 | v18.62,25.03 18.72,25.03 18.75,25 | v17.5,5.97 17.5,6
VBAT-3  (via drill 0.3)
  Top 0.127: v11.25,52.53 v11.25,50.45
  Top 0.4: VCC4.1 16.75,39.25 v15.5,40.5 | VCC1.1 30.87,49.37 v29.81,49.37 | VCC6.1 v18.5,69.5 | v1.5,69.5 v1.5,60 1.5,56 | 1.5,56 v1.5,50.5 v1.5,41 | VCC5.1 1.5,56
  Bottom 0.127: R14.2 v11.25,52.53 | v11.25,50.45 11.25,50.5
  Bottom 0.4: RGB1.1 2.46,41 | RGB4.1 30.96,41 29,41 | 2.46,41 6,41 | 6,41 12,41 | 12,41 15.5,41 | 15.5,41 19.5,41 | 19.5,41 21.5,41 | 21.5,41 29,41 | C9.2 6,41 | RGB2.1 12,39.89 12,41 | C10.2 v15.5,40.5 15.5,41 | C11.2 19.5,41 | RGB3.1 21.46,41 21.5,41 | C12.2 29,41 | RGB5.1 2.46,50.5 | 21.46,50.5 RGB7.1 | 2.46,50.5 6,50.5 | 6,50.5 11.25,50.5 12,50.5 | 12,50.5 15.5,50.5 | 15.5,50.5 19.5,50.5 | 19.5,50.5 21.46,50.5 | C15.2 19.5,50.5 | C14.2 15.5,50.5 | RGB6.1 12,49.39 12,50.5 | C13.2 6,50.5 | 29.79,49.39 C16.2 28.65,48.25 25.5,48.25 23.87,49.88 23.87,50.27 23.64,50.5 21.46,50.5 | 29.79,49.39 RGB8.1 | RGB9.1 2.46,60 | 21.46,60 RGB11.1 | 2.46,60 6,60 | 6,60 12,60 | 12,60 15.5,60 | 15.5,60 19.5,60 | 19.5,60 21.46,60 | C19.2 19.5,60 | C18.2 15.5,60 | RGB10.1 12,58.89 12,60 | C17.2 6,60 | 21.46,60 28.75,60 | C20.2 28.75,60 | RGB13.1 2.46,69.5 | RGB16.1 30.96,69.5 29,69.5 | 2.46,69.5 6,69.5 | 6,69.5 12,69.5 | 12,69.5 15.5,69.5 | 15.5,69.5 v18.5,69.5 19.5,69.5 | 19.5,69.5 21.25,69.5 | 21.25,69.5 29,69.5 | C24.2 29,69.5 | RGB15.1 21.46,69.5 21.25,69.5 | C23.2 19.5,69.5 | C22.2 15.5,69.5 | RGB14.1 11.96,69.5 12,69.5 | C21.2 6,69.5 | v29.81,49.37 29.79,49.39 | 28.75,60 29.25,60 29.75,59.5 29.75,59.25 30.11,58.89 RGB12.1 | 2.46,41 v1.5,41 | v1.5,69.5 2.46,69.5 | 2.46,60 v1.5,60 | 2.46,50.5 v1.5,50.5
VBAT-4  (via drill 0.3)
  Top 0.4: v36.5,6 v36.5,15.5 v36.5,25 v36.5,34.5 | VCC-USB-3.1 v52.5,34.5
  Bottom 0.4: RGB17.1 37.5,4.93 37.5,6 | 37.5,6 41,6 | 41,6 47,6 | 47,6 50.5,6 | 50.5,6 54.5,6 | 54.5,6 56.5,6 | 56.5,6 64,6 | 64,6 65.75,6 65.96,5.79 RGB20.1 | RGB19.1 56.5,4.93 56.5,6 | RGB18.1 46.96,5.96 47,6 | C28.2 64,6 | C27.2 54.5,6 | C26.2 50.5,6 | C25.2 41,6 | 56.5,15.5 54.5,15.5 | 54.5,15.5 50.5,15.5 | 50.5,15.5 47,15.5 | 47,15.5 41,15.5 | RGB23.1 56.5,14.43 56.5,15.5 | C31.2 54.5,15.5 | C30.2 50.5,15.5 | RGB22.1 47,14.43 47,15.5 | C29.2 41,15.5 | 37.5,15.5 37.46,15.46 RGB21.1 | 41,15.5 37.5,15.5 | 56.5,15.5 60.63,15.5 RGB24.1 62.65,11.72 C32.2 | RGB25.1 37.5,23.93 37.5,25 | 37.5,25 41,25 | 41,25 47,25 | 47,25 50.5,25 | 50.5,25 54.5,25 | 54.5,25 56.5,25 | RGB27.1 56.46,24.96 56.5,25 | C35.2 54.5,25 | C34.2 50.5,25 | RGB26.1 46.96,24.96 47,25 | C33.2 41,25 | 56.5,25 62,25 62.75,25.75 63.7,25.75 C36.2 64.97,25.6 RGB28.1 | RGB29.1 37.46,34.46 | 37.46,34.46 37.5,34.5 41,34.5 | 41,34.5 47,34.5 | 47,34.5 50.5,34.5 | 50.5,34.5 v52.5,34.5 54.5,34.5 | 54.5,34.5 56.5,34.5 | 56.5,34.5 64,34.5 | 64,34.5 65.75,34.5 65.96,34.29 RGB32.1 | C37.2 64,34.5 | RGB31.1 56.5,33.43 56.5,34.5 | C38.2 54.5,34.5 | C39.2 50.5,34.5 | RGB30.1 47,33.43 47,34.5 | C40.2 41,34.5 | 37.5,6 v36.5,6 | v36.5,34.5 37.42,34.5 37.46,34.46 | 37.5,25 v36.5,25 | 37.5,15.5 v36.5,15.5
VCC-2  (via drill 0.3, 0.35)
  Top 0.127: v20.3,18.45 20.19,18.35 IC1.14 20.19,14.47 21.83,12.83 22.44,12.83 23.25,12.02 23.25,9.83 v23.25,8 | v27.75,18.75 27.81,18.81 IC2.14 | IC3.5 12.85,13.07 v13,13.22 | v14.33,13.4 14.54,13.4 14.57,13.43 15.17,14.02 15.17,16.92 14.25,17.84 C3.1 14.52,18.92 v15.25,18.92 | R24.1 17,23.4 v17,25.58
  Top 0.4: v13.25,25.55 VCC-USB-11.1 | v18.75,25.61 18.78,25.58 18.85,25.58 19.18,25.26 19.18,24.8 19.15,24.77 19.15,21.8 18.63,21.27 18.63,20.06 17.95,19.39 v17.95,18.95 NCP114.5
  Bottom 0.127: v27.75,18.75 27.39,19.11 20.25,19.11 | v20.3,18.45 20.3,19.06 20.25,19.11 | v14.33,13.4 14.16,13.22 v13,13.22 | 20.25,19.11 18.25,19.11 18,19.11 | 18,19.11 17.25,19.11 | 17.25,19.11 17.2,19.11 | v17.95,18.95 18,19 18,19.11 | S3.1 v23.25,8 | v15.25,18.92 15.44,19.11 16.8,19.11 16.83,19.08 17.17,19.08 17.2,19.11 | 17.25,19.11 17.2,19.11
  Bottom 0.4: v13.25,25.55 13.28,25.58 v17,25.58 18.75,25.58 v18.75,25.61
VCC-3  (via drill 0.3)
  Top 0.127: U1.VCC 9.25,44.5 9.5,44.25 | v11.25,44.25 9.5,44.25 | U1.VCC 9.5,44.25 | VCC-USB-21.1 10.25,38.5 9.5,39.25 9.5,44.25 | U1.VCC 10.8,44.55 11,44.75 11,47.25 10.75,47.5 7.75,47.5 6.75,48.5 v6.75,53.5 | v29,49.81 28.76,49.56 28.76,46.74 29.5,46 v29.5,44.45
  Bottom 0.127: 21.8,53.35 R9.2 21.8,53.35 | 21.8,53.35 R6.2 24.26,54.11 24.66,54.11 26.56,56.01 27.67,56.01 28.43,55.25 28.75,55.25 29.14,54.86 ADXL345.1 29.14,54.14 29.5,54.14 29.78,54.14 30,53.92 30,53.5 30.15,53.35 C4.1 31.4,53.35 31.5,53.25 31.5,51.25 31.5,50.84 31.25,50.59 30.07,50.59 29.99,50.5 ADXL345.6 29.14,49.95 v29,49.81 | 21.8,53.35 R4.1 R5.1 R8.2 | v11.25,44.25 11.5,44.5 15.9,44.5 15.95,44.45 C1.1 17.25,43.75 17.61,43.39 17.61,43.17 17.72,43.06 18.98,43.06 19.09,43.17 19.09,44.13 19.2,44.25 23.16,44.25 23.58,43.83 23.92,43.83 24.17,44.08 24.17,44.42 24.36,44.61 27.55,44.61 27.58,44.58 27.92,44.58 27.95,44.61 29.34,44.61 v29.5,44.45 | v6.75,53.5 9.35,53.5 R2.1
VCC-USB-1  (via drill 0.3)
  Top 0.127: v50.3,51.31 50.3,49.3 49.6,48.6 | USB-C.2 62.65,50.1 62.08,50.67 v62.08,51.92
  Top 0.4: USB-C.11 64.51,54.9 65.25,54.16 65.25,50.84 64.51,50.1 USB-C.2 62.6,50.1 62,49.5 62,40.5 58.4,36.9 53.48,36.9 53.29,37.09 53.29,37.71 VCC-USB-14.1
  Bottom 0.127: v62.08,51.92 61.81,51.65 57.35,51.65 57.03,51.98 55.58,51.98 55.08,51.48 54.75,51.14 50.47,51.14 v50.3,51.31
VCC-USB-2  (via drill 0.3, 0.35)  (1 unrouted)
  Top 0.127: v8.71,7.79 8.54,7.96 8.54,10.17 9.04,10.67 9.04,11.83 8.93,11.94 8.25,11.94 8,12.19 v8,12.75 R11.2 | D1.A 14.03,13.77 13.75,13.5 v13.75,12.75 | C5.2 v14.25,21.75 | v11.5,17.75 11,17.25 | TP4056X.8 10.54,22.1 v10.6,22.17 | TP4056X.4 7.36,23.62 v7.36,23.36
  Top 0.4: v14.75,16.75 14.03,16.02 D1.A 13,15.25 11,17.25 10.54,17.71 TP4056X.8 | v29.75,17.5 VCC-USB-20.1
  Bottom 0.127: 7.29,7.54 7.3,7.54 7.54,7.79 v8.71,7.79 | v13.75,12.75 v8,12.75 | v14.25,21.75 13.83,22.17 12.33,22.17 12.16,22 10.5,22 | 10.5,22 8.11,22 7.43,22.68 7.36,22.75 v7.36,23.36 | R17.2 11.5,18.5 | 11.5,18.5 v11.5,17.75 | R16.2 13.15,18.5 11.5,18.5 | v10.6,22.17 10.5,22.06 10.5,22
  Bottom 0.4: v14.75,16.75 15.47,16.03 28.28,16.03 v29.75,17.5

## Text on the board
Bottom: JoshuaBird.com
tPlace: LedCube | V1.0 / Joshua Bird / JoshuaBird.com